# Altium schematic sheet LiDAR_Microcontroller.SchDoc
size A3; SheetNumber: 2; SheetTotal: 2
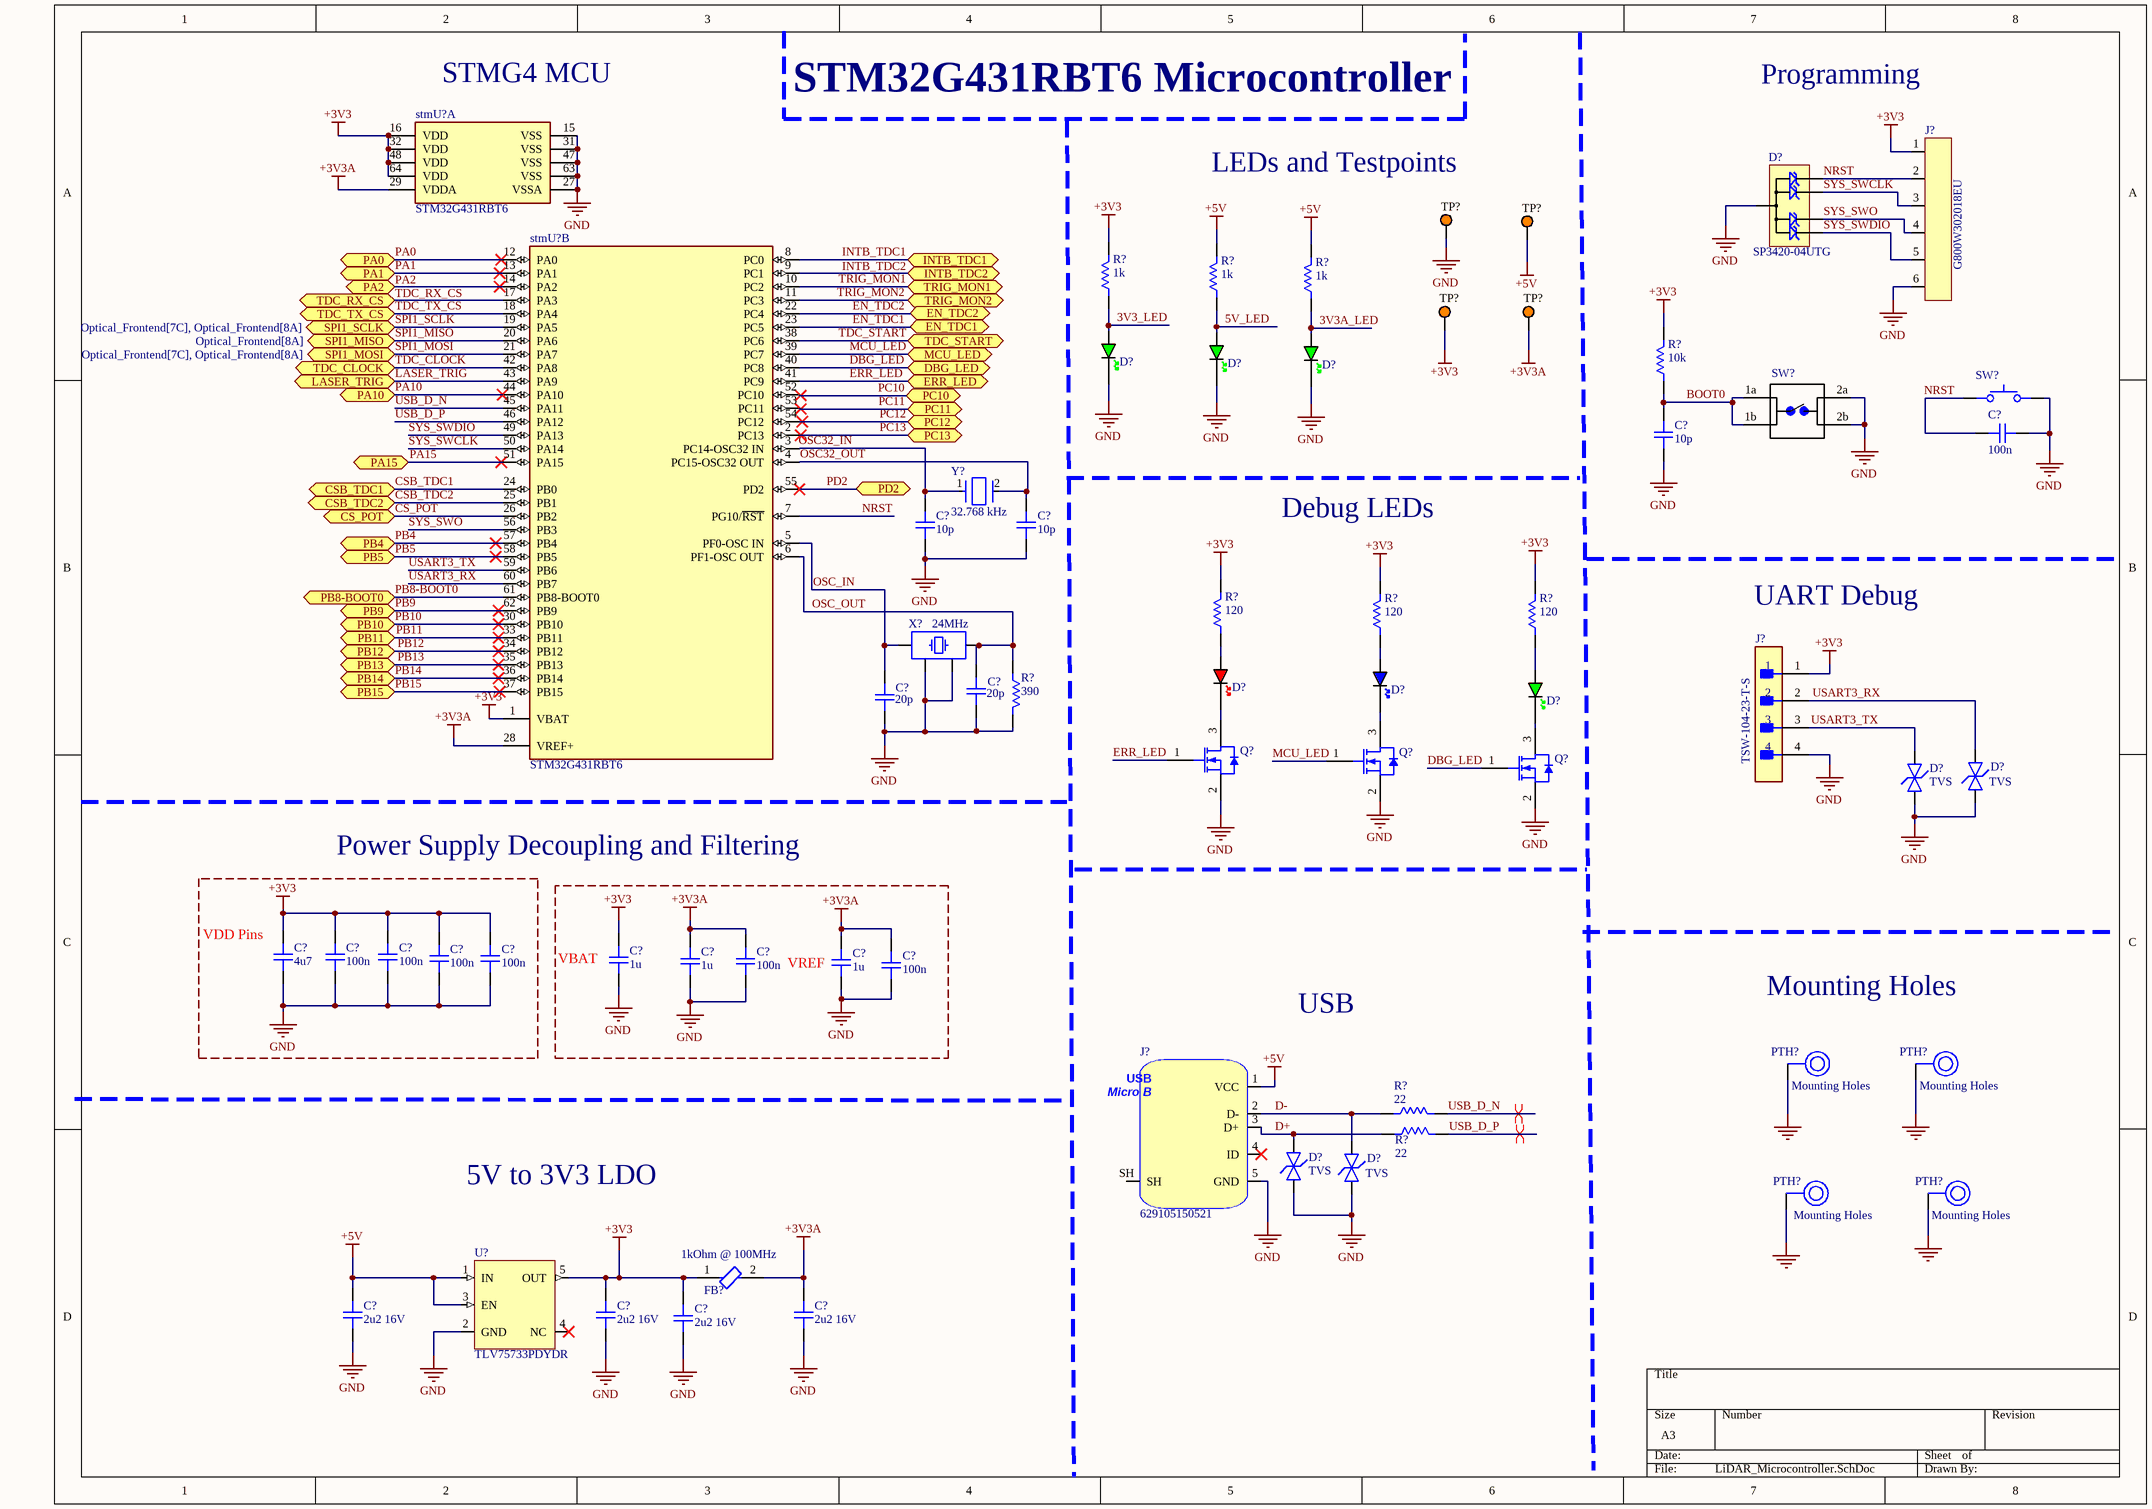
[diagram p0: LiDAR_Microcontroller.SchDoc]

## Parts
(Parts that share a designator on the sheet are numbered #1, #2 ... from top to bottom, then left to right.)
C?#1  100n  [CAP_0603]
C?#2  10p  [CAP_0603]
C?#3  10p  [CAP_0603]
C?#4  10p  [CAP_0603]
C?#5  20p  [CAP_0603]
C?#6  20p  [CAP_0603]
C?#7  4u7  [CAP_0805]
C?#8  100n  [CAP_0603]
C?#9  100n  [CAP_0603]
C?#10  100n  [CAP_0603]
C?#11  100n  [CAP_0603]
C?#12  1u  [CAP_0603]
C?#13  1u  [CAP_0603]
C?#14  100n  [CAP_0603]
C?#15  1u  [CAP_0603]
C?#16  100n  [CAP_0603]
C?#17  2u2 16V  [CAP_0603]
C?#18  2u2 16V  [CAP_0603]
C?#19  2u2 16V  [CAP_0603]
C?#20  2u2 16V  [CAP_0603]
D?#1  SP3420-04UTG  [uDFN-10]
D?#2  GREEN  [LED_0603_GREEN]  (value not drawn)
D?#3  GREEN  [LED_0603_GREEN]  (value not drawn)
D?#4  GREEN  [LED_0603_GREEN]  (value not drawn)
D?#5  RED  [LED_0603_RED]  (value not drawn)
D?#6  BLUE  [LED_0603_BLUE]  (value not drawn)
D?#7  GREEN  [LED_0603_GREEN]  (value not drawn)
D?#8  TVS  [D_0603]
D?#9  TVS  [D_0603]
D?#10  TVS  [D_0603]
D?#11  TVS  [D_0603]
FB?  1kOhm @ 100MHz  [FP-MPZ2012-MFG]
J?#1  G800W302018EU  [G800W302018EU]
J?#2  TSW-104-23-T-S  [FP-TSW-104-23-T-S-MFG]
J?#3  629105150521  [629105150521]
PTH?#1  Mounting Holes  [Mounting Hole]
PTH?#2  Mounting Holes  [Mounting Hole]
PTH?#3  Mounting Holes  [Mounting Hole]
PTH?#4  Mounting Holes  [Mounting Hole]
Q?#1  MGSF1N02LT1G  [ONSC-SOT-23-3-318-08_V]  (value not drawn)
Q?#2  MGSF1N02LT1G  [ONSC-SOT-23-3-318-08_V]  (value not drawn)
Q?#3  MGSF1N02LT1G  [ONSC-SOT-23-3-318-08_V]  (value not drawn)
R?#1  1k  [RES_0603]
R?#2  1k  [RES_0603]
R?#3  1k  [RES_0603]
R?#4  10k  [RES_0603]
R?#5  120  [RES_0402]
R?#6  120  [RES_0402]
R?#7  120  [RES_0402]
R?#8  390  [RES_0603]
R?#9  22  [RES_0402]
R?#10  22  [RES_0402]
stmU?#1  STM32G431RBT6  [FP-LQFP64-5W-MFG]  (part A of 2)
stmU?#2  STM32G431RBT6  [FP-LQFP64-5W-MFG]  (part B of 2)
SW?#1  SKRPANE010  [SKRPANE010]  (value not drawn)
SW?#2  Switch 6mm 24V (NO)  [Switch 6mm 24V (NO)]  (value not drawn)
TP?#1  5013  [KSTN-5013_V]  (value not drawn)
TP?#2  5013  [KSTN-5013_V]  (value not drawn)
TP?#3  5013  [KSTN-5013_V]  (value not drawn)
TP?#4  5013  [KSTN-5013_V]  (value not drawn)
U?  TLV75733PDYDR  [TLV75733PDYDR]
X?  24MHz  [XTAL_3225]
Y?  32.768 kHz  [FP-ABS07-MFG]

## Blocks framed on the sheet
Power Supply Decoupling and Filtering: C?#7-C?#11

## Ports
CS_POT (bidir), CSB_TDC1 (bidir), CSB_TDC2 (bidir), DBG_LED (bidir), EN_TDC1 (bidir), EN_TDC2 (bidir), ERR_LED (bidir), INTB_TDC1 (bidir), INTB_TDC2 (bidir), LASER_TRIG (bidir), MCU_LED (bidir), PA0 (bidir), PA1 (bidir), PA2 (bidir), PA10 (bidir), PA15 (bidir), PB4 (bidir), PB5 (bidir), PB8-BOOT0 (bidir), PB9 (bidir), PB10 (bidir), PB11 (bidir), PB12 (bidir), PB13 (bidir), PB14 (bidir), PB15 (bidir), PC10 (bidir), PC11 (bidir), PC12 (bidir), PC13 (bidir), PD2 (bidir), SPI1_MISO (bidir, see Optical_Frontend[8A]), SPI1_MOSI (bidir, see Optical_Frontend[7C], Optical_Frontend[8A]), SPI1_SCLK (bidir, see Optical_Frontend[7C], Optical_Frontend[8A]), TDC_CLOCK (bidir), TDC_RX_CS (bidir), TDC_START (bidir), TDC_TX_CS (bidir), TRIG_MON1 (bidir), TRIG_MON2 (bidir)

## Nets
+3V3: C?#7.2 C?#8.2 C?#9.2 C?#10.2 C?#11.2 C?#12.2 C?#18.2 C?#19.2 FB?.1 J?#1.1 J?#2.1 R?#1.2 R?#4.1 R?#5.2 R?#6.2 R?#7.2 stmU?#1.16(VDD) stmU?#1.32(VDD) stmU?#1.48(VDD) stmU?#1.64(VDD) stmU?#2.1(VBAT) TP?#3.1 U?.5(OUT)
+3V3A: C?#13.2 C?#14.2 C?#15.2 C?#16.2 C?#20.2 FB?.2 stmU?#1.29(VDDA) stmU?#2.28(VREF+) TP?#4.1
+5V: C?#17.2 J?#3.1(VCC) R?#2.2 R?#3.2 TP?#2.1 U?.1(IN) U?.3(EN)
GND: C?#1.1 C?#2.1 C?#3.1 C?#4.1 C?#5.1 C?#6.1 C?#7.1 C?#8.1 C?#9.1 C?#10.1 C?#11.1 C?#12.1 C?#13.1 C?#14.1 C?#15.1 C?#16.1 C?#17.1 C?#18.1 C?#19.1 C?#20.1 D?#1.38(GND) D?#2.K D?#3.K D?#4.K D?#8.A D?#9.A D?#10.A D?#11.A J?#1.6 J?#2.4 J?#3.5(GND) PTH?#1.1 PTH?#2.1 PTH?#3.1 PTH?#4.1 Q?#1.2(S) Q?#2.2(S) Q?#3.2(S) R?#8.1 stmU?#1.15(VSS) stmU?#1.27(VSSA) stmU?#1.31(VSS) stmU?#1.47(VSS) stmU?#1.63(VSS) SW?#1.34 SW?#2.2a SW?#2.2b TP?#1.1 U?.2(GND) X?.2 X?.4
3V3_LED: D?#2.A R?#1.1
3V3A_LED: D?#4.A R?#3.1
5V_LED: D?#3.A R?#2.1
BOOT0: C?#2.2 R?#4.2 SW?#2.1a SW?#2.1b
CS_POT: stmU?#2.26(PB2) ; port CS_POT
CSB_TDC1: stmU?#2.24(PB0) ; port CSB_TDC1
CSB_TDC2: stmU?#2.25(PB1) ; port CSB_TDC2
D+: D?#10.K J?#3.3(D+) R?#10.1
D-: D?#11.K J?#3.2(D-) R?#9.1
DBG_LED: Q?#3.1(G) stmU?#2.40(PC8) ; port DBG_LED
EN_TDC1: stmU?#2.23(PC5) ; port EN_TDC1
EN_TDC2: stmU?#2.22(PC4) ; port EN_TDC2
ERR_LED: Q?#1.1(G) stmU?#2.41(PC9) ; port ERR_LED
INTB_TDC1: stmU?#2.8(PC0) ; port INTB_TDC1
INTB_TDC2: stmU?#2.9(PC1) ; port INTB_TDC2
LASER_TRIG: stmU?#2.43(PA9) ; port LASER_TRIG
MCU_LED: Q?#2.1(G) stmU?#2.39(PC7) ; port MCU_LED
NRST: C?#1.2 D?#1.110 J?#1.2 stmU?#2.7(PG10/~{RST}) SW?#1.12
OSC32_IN: C?#3.2 stmU?#2.3(PC14-OSC32_IN) Y?.1
OSC32_OUT: C?#4.2 stmU?#2.4(PC15-OSC32_OUT) Y?.2
OSC_IN: C?#5.2 stmU?#2.5(PF0-OSC_IN) X?.1
OSC_OUT: C?#6.2 R?#8.2 stmU?#2.6(PF1-OSC_OUT) X?.3
PA0: stmU?#2.12(PA0) ; port PA0
PA1: stmU?#2.13(PA1) ; port PA1
PA2: stmU?#2.14(PA2) ; port PA2
PA10: stmU?#2.44(PA10) ; port PA10
PA15: stmU?#2.51(PA15) ; port PA15
PB4: stmU?#2.57(PB4) ; port PB4
PB5: stmU?#2.58(PB5) ; port PB5
PB8-BOOT0: stmU?#2.61(PB8-BOOT0) ; port PB8-BOOT0
PB9: stmU?#2.62(PB9) ; port PB9
PB10: stmU?#2.30(PB10) ; port PB10
PB11: stmU?#2.33(PB11) ; port PB11
PB12: stmU?#2.34(PB12) ; port PB12
PB13: stmU?#2.35(PB13) ; port PB13
PB14: stmU?#2.36(PB14) ; port PB14
PB15: stmU?#2.37(PB15) ; port PB15
PC10: stmU?#2.52(PC10) ; port PC10
PC11: stmU?#2.53(PC11) ; port PC11
PC12: stmU?#2.54(PC12) ; port PC12
PC13: stmU?#2.2(PC13) ; port PC13
PD2: stmU?#2.55(PD2) ; port PD2
SPI1_MISO: stmU?#2.20(PA6) ; port SPI1_MISO
SPI1_MOSI: stmU?#2.21(PA7) ; port SPI1_MOSI
SPI1_SCLK: stmU?#2.19(PA5) ; port SPI1_SCLK
SYS_SWCLK: D?#1.29 J?#1.3 stmU?#2.50(PA14)
SYS_SWDIO: D?#1.56 J?#1.5 stmU?#2.49(PA13)
SYS_SWO: D?#1.47 J?#1.4 stmU?#2.56(PB3)
TDC_CLOCK: stmU?#2.42(PA8) ; port TDC_CLOCK
TDC_RX_CS: stmU?#2.17(PA3) ; port TDC_RX_CS
TDC_START: stmU?#2.38(PC6) ; port TDC_START
TDC_TX_CS: stmU?#2.18(PA4) ; port TDC_TX_CS
TRIG_MON1: stmU?#2.10(PC2) ; port TRIG_MON1
TRIG_MON2: stmU?#2.11(PC3) ; port TRIG_MON2
USART3_RX: D?#9.K J?#2.2 stmU?#2.60(PB7)
USART3_TX: D?#8.K J?#2.3 stmU?#2.59(PB6)
USB_D_N: R?#9.2 stmU?#2.45(PA11)
USB_D_P: R?#10.2 stmU?#2.46(PA12)
NetD?#5_A: D?#5.A R?#5.1
NetD?#5_K: D?#5.K Q?#1.3(D)
NetD?#6_A: D?#6.A R?#6.1
NetD?#6_K: D?#6.K Q?#2.3(D)
NetD?#7_A: D?#7.A R?#7.1
NetD?#7_K: D?#7.K Q?#3.3(D)

Not connected (* = marked no-connect by the designer): J?#3 4(ID)* SH; U? 4(NC)*

## Layout directives
differential pair; differential pair class USB_DIFF_PAIR: USB_D_N, USB_D_P

## Notes on the sheet
- (near stmU?#1) STMG4 MCU
- STM32G431RBT6 Microcontroller
- Programming
- (near TP?#1) LEDs and Testpoints
- Debug LEDs
- UART Debug
- (near C?#7) VDD Pins
- (near C?#12) VBAT
- (near C?#15) VREF
- USB
- Mounting Holes
- 5V to 3V3 LDO
- Labels drawn without touching a wire or pin: INTB_TDC2, PA2, TDC_RX_CS
- (in symbol 629105150521) USB; Micro B

## Library data of the parts
C?#1 C?#8-C?#11 C?#14 C?#16 = MAJCH168BB7104KTEA01: Multilayer Ceramic Capacitors MLCC - SMD/SMT 100V 0.1uF 0603 X7R 10% AECQ2; Manufacturer: TAIYO YUDEN; Rating: 100nF 100V X7R 0603 10%; Manufacturer Part Number: MAJCH168BB7104KTEA01; Distributor Link: https://www.mouser.tw/en/ProductDetail/TAIYO-YUDEN/MAJCH168BB7104KTEA01?qs=ZcfC38r4PovaTBrG0IdezQ%3D%3D; Datasheet Link: https://www.mouser.com/catalog/specsheets/TAIYO_YUDEN_03-08-2024_MAJCH168BB7104KTEA01_SS.pdf?_gl=1*17qbpp1*_gcl_aw*R0NMLjE3ODUyMjg2NDkuQ2p3S0NBandwcUhUQmhBY0Vpd0FqMkFmdXJYOV9OUy1CV0xFSmd6T0FaYy1HZXR1bHVfaUZmaHVzRkI2bHhkODVUMjVSNlJWbnBOUkFob0NEdHNRQXZEX0J3RQ..*_gcl_au*MTM0NzYwMzc0Mi4xNzgyNDQ3MDMwLjE4MDQ0Nzg2ODUuMTc4NTI5MDg4OS4xNzg1MjkxOTE2LjE1NDk0Mzk5MTcuMTc4NTIxODYwOC4xNzg1MjkxOTE2*_ga*MTg5NTU5OTIyLjE3ODI0NDcwMzM.*_ga_15W4STQT4T*czE3ODUyODM3NTgkbzk5JGcxJHQxNzg1MjkxOTI1JGo0MiRsMCRoMA..; Dielectric: *
C?#2-C?#4 = C0603C100K1RACTU: Multilayer Ceramic Capacitors MLCC - SMD/SMT 100V 10pF 10% X7R 0603; Manufacturer: KEMET; Rating: 10pF 100V 10% X7R 0603; Manufacturer Part Number: C0603C100K1RACTU; Distributor Link: https://www.mouser.tw/en/ProductDetail/KEMET/C0603C100K1RACTU?qs=hzBznG4dWXU4WScX4diOfA%3D%3D; Datasheet Link: https://www.mouser.tw/datasheet/3/508/1/KEM_C1002_X7R_SMD.pdf; Dielectric: *
C?#5 C?#6 = C0603C200J5RACTU: Multilayer Ceramic Capacitors MLCC - SMD/SMT 50V 20pF 5% X7R 0603; Manufacturer: KEMET; Rating: 20p 50V X7R 0603; Manufacturer Part Number: Multilayer Ceramic Capacitors MLCC - SMD/SMT 50V 20pF 5% X7R 0603; Distributor Link: https://www.mouser.tw/datasheet/3/72/1/KEM_C1002_X7R_SMD.pdf; LCSC: N/A; Dielectric: *
C?#7 = CGA4J1X7R1H475K125AC: Multilayer Ceramic Capacitors MLCC - SMD/SMT 0805 50VDC 4.7uF 10% AEC-Q200; Manufacturer: TDK; Rating: 4.7uF 50V X7R 10% 0805; Manufacturer Part Number: CGA4J1X7R1H475K125AC; Distributor Link: https://www.mouser.tw/en/ProductDetail/TDK/CGA4J1X7R1H475K125AC?qs=PqoDHHvF64%252BmskN2S82T2g%3D%3D; Datasheet Link: https://product.tdk.com/system/files/dam/doc/product/capacitor/ceramic/mlcc/catalog/mlcc_automotive_general_en.pdf?ref_disty=mouser; Dielectric: *
C?#12 C?#13 C?#15 = C0603X105K9RACAUTO: Multilayer Ceramic Capacitors MLCC - SMD/SMT 6.3 Vo 1 uF 0603 X7R 10 % AECQ200; Manufacturer: KEMET; Rating: 1u 6.3V X7R 0603; Manufacturer Part Number: C0603X105K9RACAUTO; Distributor Link: https://www.mouser.tw/datasheet/3/72/1/C0603X105K9RACAUTO.pdf; LCSC: N/A; Dielectric: *
C?#17-C?#20 = 0603X225K160CT: Multilayer Ceramic Capacitors MLCC - SMD/SMT 2.2uF +-10% 16V; Manufacturer: Walsin; Rating: 2.2uF 16V 10% 0603 X5R; Manufacturer Part Number: 0603X225K160CT; Distributor Link: https://www.mouser.tw/en/ProductDetail/Walsin/0603X225K160CT?qs=sGAEpiMZZMsh%252B1woXyUXj9Vc%2FsqQGnyVueqjdyLsCyQ%3D; Datasheet Link: N/A; Dielectric: *
D?#1 = SP3420-04UTG: TVS Diode Array Low Capacitance ESD Protection 4-Channel (Vwork=3V3, Vclamp=6V); Manufacturer: Littelfuse; Manufacturer Part Number: SP3420-04UTG
D?#2-D?#4 D?#7 = LED_0603_GREEN: LED 0603 GREEN SMD
D?#5 = LED_0603_RED: LED 0603 RED SMD
D?#6 = LED_0603_BLUE: LED 0603 BLUE SMD
D?#8-D?#11 = D_TVS_BI_0603: Diode TVS / ESD Bidirectional 0603; Manufacturer: *; Manufacturer Part Number: *
FB? = CMP-08257-000025-1: FERRITE BEAD 1 KOHM 0805 1LN; Max Current Rating: 1.5A; Tolerance: 25%; Number of Lines: 1; DC Resistance (DCR): 150mR; Impedance: 1kR; Case Code (Metric): 2012; Mount: Surface Mount; Case/Package: 0805; Case Code (Imperial): 0805; Height: 0.041inch; Max DC Current: 1.5A; Min Operating Temperature: -55°C; Length: 0.079inch; Width: 1.25mm; Ratings: AEC-Q200; Packaging: Tape and Reel; RoHS Compliant: Yes; Termination: SMD/SMT; Test Frequency: 100MHz; Package Quantity: 4000; Weight: 0.000194oz; Max Operating Temperature: 125°C; Lead Free: Lead Free
J?#1 = G800W302018EU: Pin Header 6 Position 2.54mm Pitch; Manufacturer: Amphenol; Manufacturer Part Number: G800W302018EU
J?#2 = CMP-02766-001388-1: CONN HEADER VERT 4POS 2.54MM; Number of Contacts: 4; Gender: Male; Connector Type: Male Pin; Max Voltage Rating (AC): 550V; Max Current Rating: 7.6A; Radiation Hardening: No; Lead Free: Lead Free; RoHS Compliant: Yes; Contact Material: Bronze; Number of Positions: 4; Housing Color: Black; Min Operating Temperature: -55°C; Mount: Through Hole; Number of Rows: 1; Orientation: Straight; Contact Mating Length: 0.23inch; Contact Type: Male Pin; REACH SVHC: No SVHC; Max Operating Temperature: 105°C; Color: Black; Pitch: 2.54mm; Length: 10.16mm; Series: TSW; Packaging: Bulk; Contact Plating: Tin; Package Quantity: 1; Termination: Solder; Housing Material: Polyester; Width: 2.54mm; Depth: 2.54mm
J?#3 = 629105150521: USB Connector Type Micro B 2.0 SMD; Manufacturer: Wurth; Manufacturer Part Number: 629105150521; Distributor Link: https://www.mouser.de/ProductDetail/Wurth-Elektronik/629105150521?qs=a9WhcLg8qCzXiH7kZP8GRQ%3D%3D
PTH?#1-PTH?#4 = Mounting Holes: I'm so sick of having to manually make these everytime with a different size, and how in the world do do I make one like Phil's Lab with Gnd vias around it?
Q?#1-Q?#3 = CMP-1058-00777-1: Power MOSFET, 750 mA, 20 V, N-Channel, 3-Pin SOT-23, Pb-Free, Tape and Reel; Manufacturer: On Semiconductor; Crss Typ (pF): 45; Ciss Typ (pF): 125; VGS(th) Max (V): 2.4; Coss Typ (pF): 120; PD Max (W): 0.4; VGS Max (V): 20; Configuration: Single; Channel Polarity: N Channel; ID Max (A): 0.75; PackageReference: SOT-23-3-318-08; ComponentLink2Description: Datasheet; PackageVersion: Rev. AP, 11/2009; ComponentLink1URL: http://www.onsemi.com/; RoHS: Pb-Free; Mounting Technology: Surface Mount; Package Type: SOT-23-3; ComponentLink1Description: Manufacturer URL; V(BR)DSS Min (V): 20; PackageDescription: 3-Pin Small Outline Transistor, Body 2.92 x 1.3 mm, Pitch 0.95 mm; Packing: Tape and Reel; PartNumber: MGSF1N02LT1G; DatasheetVersion: Rev. 6; ComponentLink2URL: http://www.onsemi.cn/pub_link/Collateral/MGSF1N02LT1-D.PDF; ComponentLink3URL: http://www.onsemi.cn/pub_link/Collateral/318-08.PDF; ComponentLink3Description: Package Specification
R?#1-R?#3 = AC0603JR-071KL: Thick Film Resistors - SMD 1 kOhms 1/10 W 75 V 5% 0603 100 PPM / C - 55 C / + 155 C AEC-Q200; Manufacturer: YAGEO; Values: 1k 1/10W 5% 0603; Manufacturer Part Number: AC0603JR-071KL; Distributor Link: https://www.mouser.tw/en/ProductDetail/YAGEO/AC0603JR-071KL?qs=ygRr%2FtkhtetUuJMpTs3DCw%3D%3D; Datasheet Link: https://www.mouser.tw/datasheet/3/508/1/PYU_AC_51_ROHS_L.pdf
R?#4 = CRCW060310K0FKEI: Thick Film Resistors - SMD 10K OHM 1%; Manufacturer: Vishay; Value: 10k 1% 1/8W 0603; Manufacturer Part Number: CRCW060310K0FKEI; Distributor Link: https://www.vishay.com/docs/20035/dcrcwe3.pdf
R?#5-R?#7 = CRCW0402120RFKED: Thick Film Resistors - SMD 1/10 Watt 120ohms 1%; Manufacturer: Vishay; Ratings: 120ohm 1/10W 1% 0402; Manufacturer Part Number: CRCW0402120RFKED; Distributor Link: https://www.mouser.tw/en/ProductDetail/Vishay/CRCW0402120RFKED?qs=sGAEpiMZZMtlubZbdhIBIFsfWmIKznfcAq4ywTsUxJY%3D; Datasheet: https://www.vishay.com/docs/20035/dcrcwe3.pdf
R?#8 = ERA-3VEB3900V: Thin Film Resistors - SMD 0603 0.1% 390ohm 25ppm SMD; Manufacturer: Panasonic; Ratings: 390ohm 0603 0.1% 1/8W; Manufacturer Part Number: ERA-3VEB3900V; Distributor Link: https://industrial.panasonic.com/cdbs/www-data/pdf/RDM0000/RDM0000C331.pdf; LCSC: N/A
R?#9 R?#10 = CRCW040222R0FKEE_1: Thick Film Resistors - SMD D10/CRCW0402 100 22R 1% EF4 E3; Manufacturer: Vishay; Ratings: 22ohm, 1/10W, 1%, 0402; Manufacturer Part Number: CRCW040222R0FKEE; Distributor Link: https://www.mouser.com/en/ProductDetail/Vishay/CRCW040222R0FKEE?qs=sGAEpiMZZMtlubZbdhIBIKbhzOdzan%2FGSLcVnipjjiw%3D; Datasheet Link: https://www.vishay.com/docs/20035/dcrcwe3.pdf
stmU?#1 stmU?#2 = CMP-12105-000150-1: IC MCU 32BIT 128KB FLASH 64LQFP; RoHS Compliant: Yes
SW?#1 = SKRPANE010: Tactile Switch SMD SPST; Manufacturer: Alps Alpine; Manufacturer Part Number: SKRPANE010
SW?#2 = CMP-007-0002-3: Switch Tactile OFF (ON) SPST Round Button PC Pins 0.05A 24VDC 100000Cycles 2.55N Thru-Hole Loose; Actuator Material: PBT; Contact Resistance: 100mR; Max Current Rating: 50mA; Actuator Color: Red; Switch Travel: 0.25mm; Illumination Type: Non-Illuminated,Illuminated; Actuator Type: Standard; Switch Function: Off-Mom; Actuator Length: 0.055inch; Max Voltage Rating (DC): 24V; Max Operating Temperature: 85°C; Depth: 7.8mm; Length: 5.99mm; Package Quantity: 750; Min Operating Temperature: -35°C; Mechanical Life: 100000Cycles; Mount: Through Hole; Voltage Rating (DC): 24V; Operating Force: 2.55N; Contact Plating: Silver; Electrical Life: 100000Cycles; Contact Current Rating: 50mA; Series: FSMJ; REACH SVHC: Unknown; Type: Switch; Lead Free: Lead Free; Contact Material: Copper Alloy; RoHS Compliant: Yes; Orientation: Straight; ELV: Compliant; Throw Configuration: SPST; Termination: PC Pins; Packaging: Loose Piece; Radiation Hardening: No
TP?#1-TP?#4 = CMP-1672-00005-4: Test Point, Orange, Through Hole, RoHS, Bulk; Manufacturer: Keystone; REACH SVHC: No SVHC; ComponentLink2Description: Datasheet; PackageDescription: 1-Pin Through Hole Device, Dia 3.17 mm; Package Quantity: 100; PackageReference: 5013; Contact Material: Bronze; DatasheetVersion: Rev. F, 12/2013; ComponentLink2URL: http://www.keyelco.com/product-pdf.cfm?p=1322; Contact Plating: Silver; ComponentLink1URL: http://www.keyelco.com/; Packaging: Bulk; ComponentLink1Description: Manufacturer URL; Colour: Orange; Height: 8.12 mm; RoHSCompliant: True; Mount: Through Hole; Mounting Technology: Through Hole
U? = TLV75733PDYDR: LDO Voltage Regulators 1-A low-IQ high-acc uracy low-dropout (L / Low dropout: / – 425mV (maximum) at 1A (3.3VOUT) / • Input voltage range: 1.45V to 5.5V; Manufacturer Name: Texas Instruments; ComponentLink1Description: Distributor Link; ComponentLink1URL: https://www.mouser.tw/en/ProductDetail/Texas-Instruments/TLV75733PDYDR?qs=ZcfC38r4PovvOY4HwNOrpQ%3D%3D; ComponentLink2Description: Datasheet Link; ComponentLink2URL: https://www.ti.com/lit/gpn/tlv757p; Ratings: Input voltage range: 1.45V to 5.5V
X? = TSX-3225_24.0000MF15X-AC: Crystal SMD 24MHz 10PPM 7pF 3225; Manufacturer: Epson; Manufacturer Part Number: TSX-3225 24.0000MF15X-AC
Y? = CMP-0447-00001-4: Crystal 32.768kHz ±20ppm (Tol) 12.5pF FUND 70kΩ 2-Pin CSMD T/R; ESR (Equivalent Series Resistance): 70kR; Radiation Hardening: No; Frequency: 32.768kHz; Length: 3.2mm; Max Operating Temperature: 85°C; Number of Pins: 2; Series: ABS07; Min Operating Temperature: -40°C; Frequency Tolerance: 20ppm; Packaging: Tape and Reel; Height: 0.9mm; Width: 1.5mm; Depth: 1.5mm; Load Capacitance: 12.5pF; RoHS Compliant: Yes; Tolerance: 20ppm; Termination: SMD/SMT; Lead Free: Lead Free; Series Resistance: 70kR; REACH SVHC: No SVHC; Case/Package: CSMD; Operating Frequency: 32.768 kHz; Package Quantity: 3000